# Altium schematic sheet Connector-Sheet.SchDoc
size 420 x 297 mm; SheetNumber: 7; SheetTotal: 7
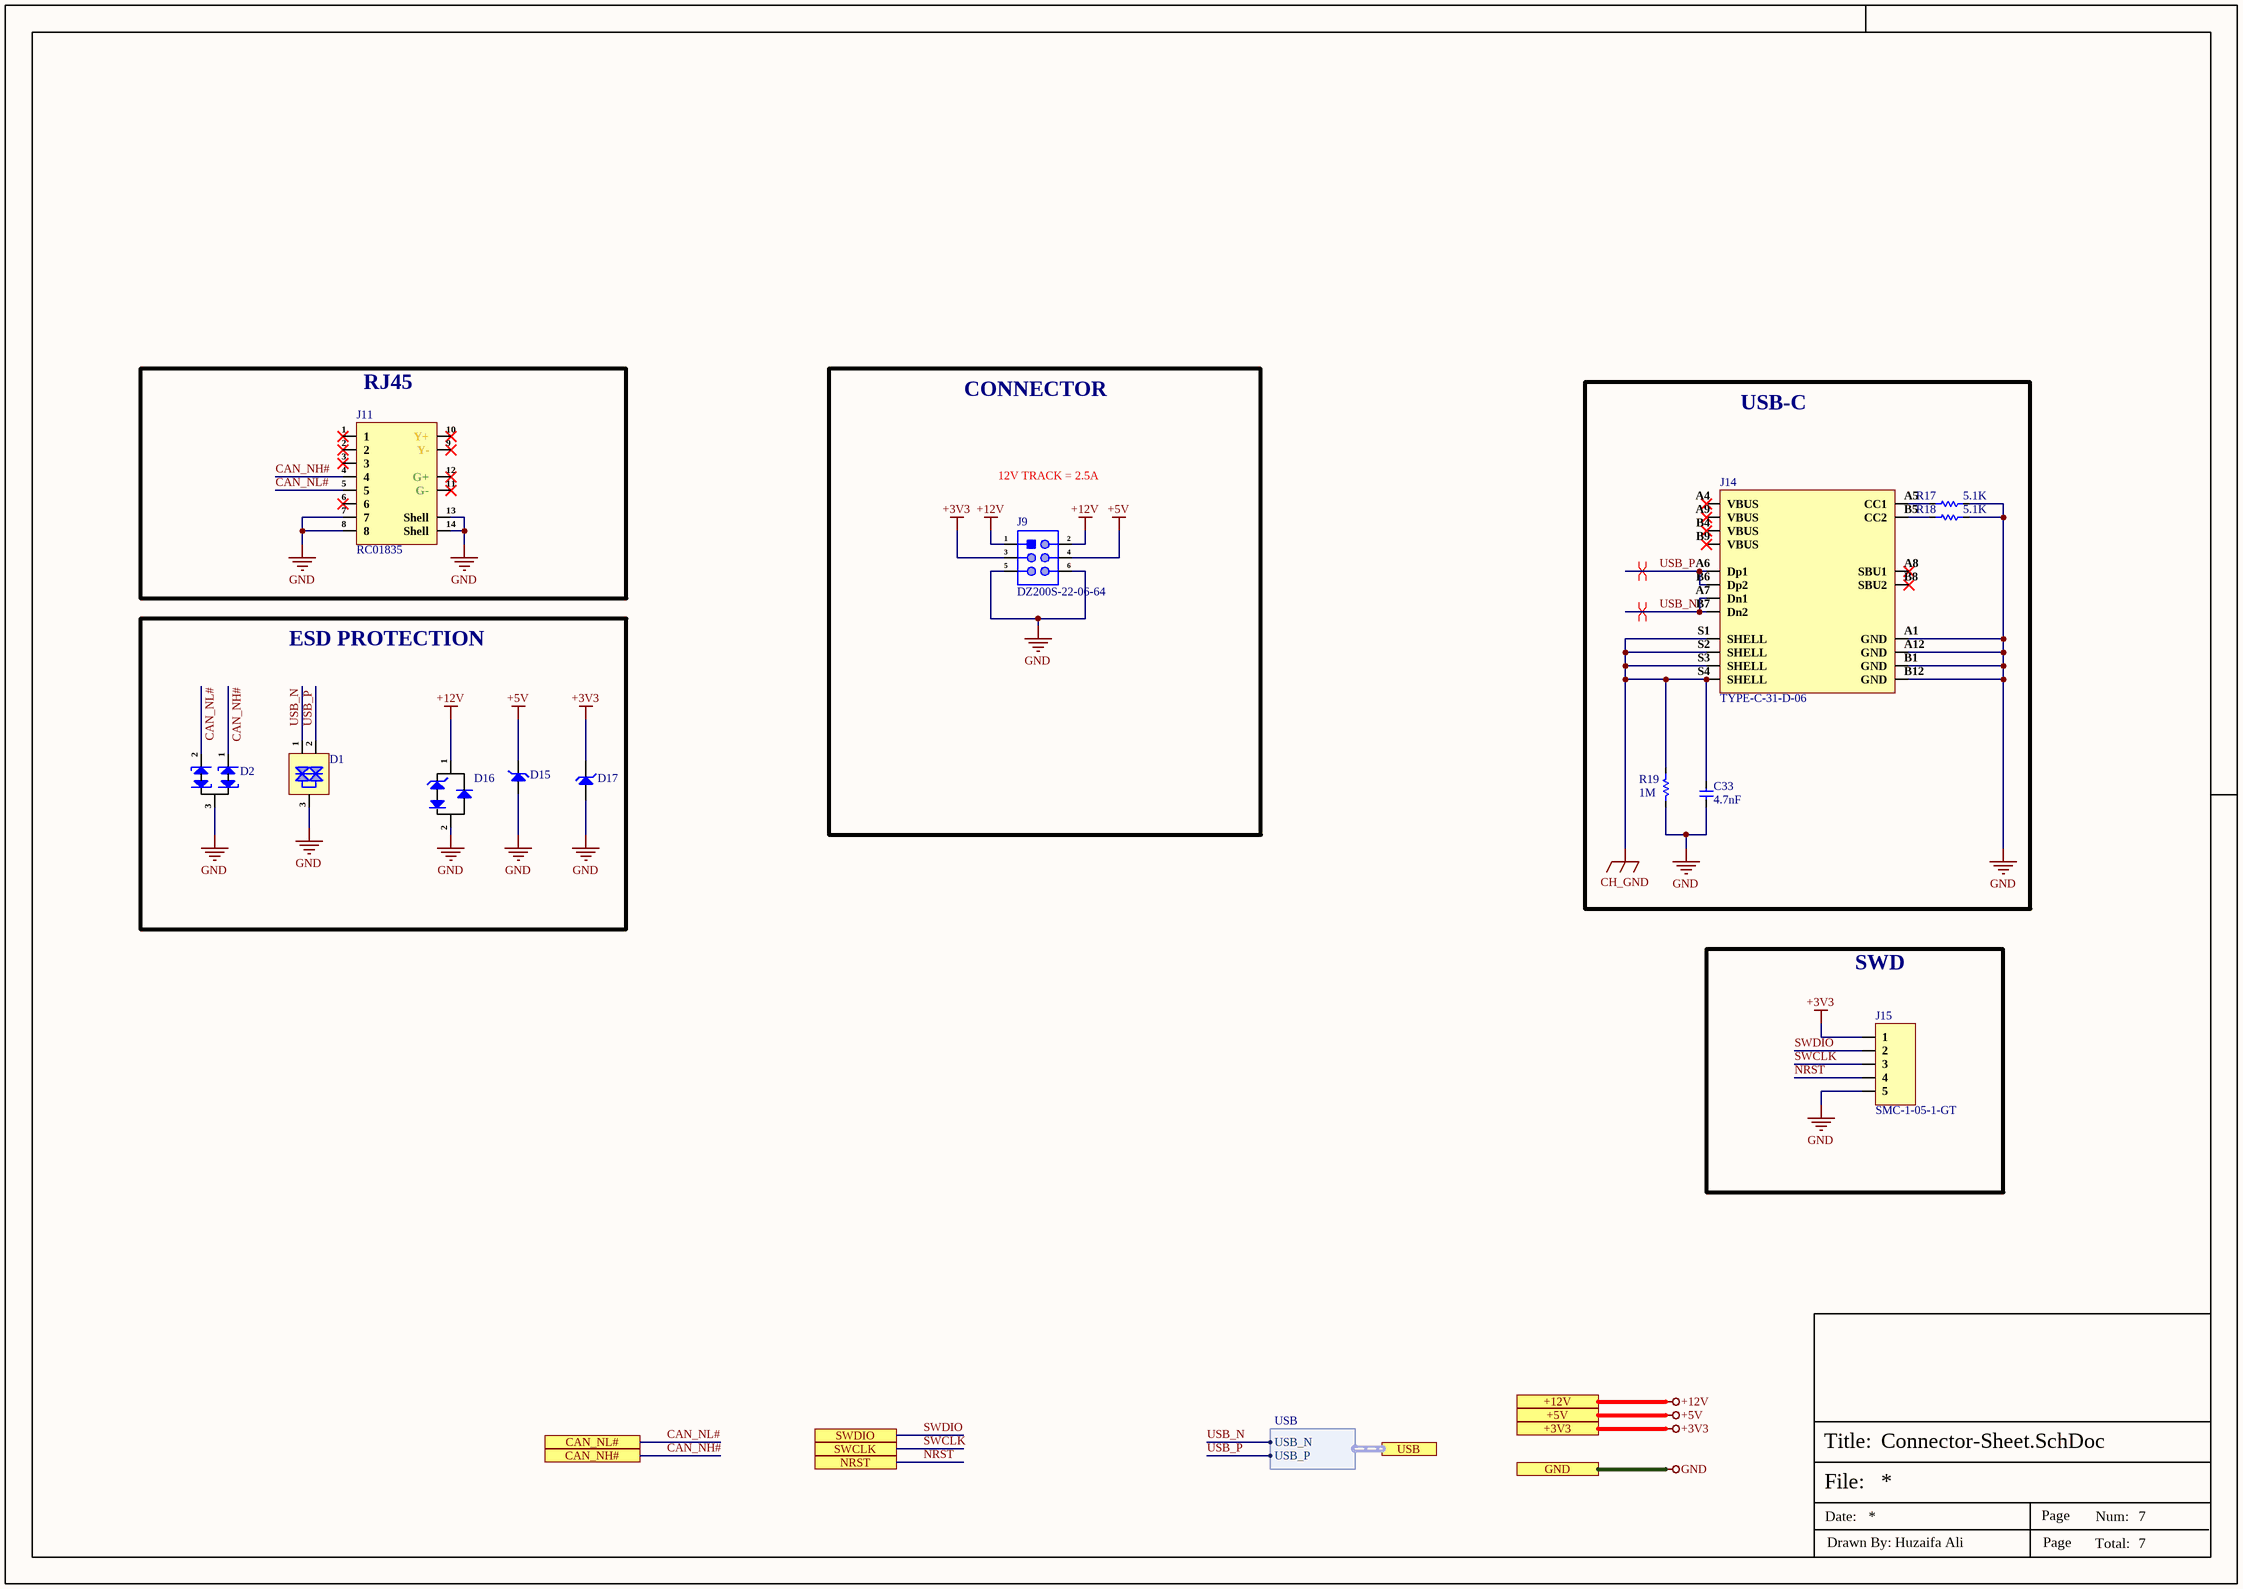
[diagram p0: Connector-Sheet.SchDoc]

## Parts
C33  4.7nF  [Cap-1206]
D1  ESD5302F-3/TR  [Sot-23]  (value not drawn)
D2  PESD2CAN,215  [SOT-23]  (value not drawn)
D15  P6SMB6.8A  [SMB_]  (value not drawn)
D16  SD12LC  [SOD-323]  (value not drawn)
D17  AZ3003-01G  [SOD-123]  (value not drawn)
J9  DZ200S-22-06-64  [HDR 2x3 Male SMD(2mm Pitch)]
J11  RC01835  [RC01835]
J14  TYPE-C-31-D-06  [TYPE-C-31-D-06]
J15  SMC-1-05-1-GT  [SMC-1-05-1-GT]
R17  5.1K  [Res-0402]
R18  5.1K  [Res-0402]
R19  1M  [Res-0603]

## Blocks framed on the sheet
RJ45: J11
CONNECTOR: J9
USB-C: C33 J14 R17-R19
ESD PROTECTION: D1 D2 D15-D17
SWD: J15

## Ports
+3V3 (see Top-Sheet[2B], CAN-Sheet[5D], Controller-Sheet[5D], Current-Sense-Sheet[5D], Motor-Driver-Sheet[5D]), +5V (see Top-Sheet[2A], CAN-Sheet[5D], Motor-Connector[5D]), +12V (see Top-Sheet[2A], Motor-Driver-Sheet[5D]), CAN_NH# (see Top-Sheet[2B], CAN-Sheet[2D]), CAN_NL# (see Top-Sheet[2B], CAN-Sheet[2D]), GND (see Top-Sheet[2B], CAN-Sheet[5D], Controller-Sheet[5D], Current-Sense-Sheet[5D], Motor-Connector[5D], Motor-Driver-Sheet[5D]), NRST (see Top-Sheet[2A], Controller-Sheet[5D]), SWCLK (see Top-Sheet[2B], Controller-Sheet[5D]), SWDIO (see Top-Sheet[2A], Controller-Sheet[5D]), USB (harness USB, see Top-Sheet[2B], Controller-Sheet[4D])

## Harnesses
USB: USB_N, USB_P

## Nets
+3V3: D17.2(K) J9.3 J15.1 ; port +3V3
+5V: D15.2(C) J9.4 ; port +5V
+12V: D16.1(K) J9.1 J9.2 ; port +12V
CH_GND: C33.1 J14.S1(SHELL) J14.S2(SHELL) J14.S3(SHELL) J14.S4(SHELL) R19.1
GND: C33.2 D1.3(GND) D2.3(C_K) D15.1(A) D16.2(A/K) D17.1(A) J9.5 J9.6 J11.7 J11.8 J11.13(Shell) J11.14(Shell) J14.A1(GND) J14.A12(GND) J14.B1(GND) J14.B12(GND) J15.5 R17.2 R18.2 R19.2 ; port GND
CAN_NH#: D2.1(K1) J11.4 ; port CAN_NH#
CAN_NL#: D2.2(K2) J11.5 ; port CAN_NL#
NRST: J15.4 ; port NRST
SWCLK: J15.3 ; port SWCLK
SWDIO: J15.2 ; port SWDIO
USB_N: D1.1(I/O1) J14.A7(Dn1) J14.B7(Dn2) ; port USB.USB_N
USB_P: D1.2(I/O2) J14.A6(Dp1) J14.B6(Dp2) ; port USB.USB_P
NetJ14_A5: J14.A5(CC1) R17.1
NetJ14_B5: J14.B5(CC2) R18.1

Not connected (* = marked no-connect by the designer): J11 1* 2* 3* 6* 9(Y-)* 10(Y+)* 11(G-)* 12(G+)*; J14 A4(VBUS)* A8(SBU1)* A9(VBUS)* B4(VBUS)* B8(SBU2)* B9(VBUS)*

## Layout directives
differential pair; net class USB; differential pair class USB_Lines; rule Impedance Constraint [Min = 88.00    Max = 90.00    ]; rule Matched Net Lengths [Tolerance = 20mil]: USB_N, USB_P

## Notes on the sheet
- 12V TRACK = 2.5A
- File:
- Title:
- Date:
- Page
- Num:
- Total:
- Drawn By: Huzaifa Ali

## Library data of the parts
C33 = CC1206KKX7RCBB472: CAP CER 4700PF 1KV X7R 1206; Manufacturer: Yageo; Dielectric Material: Ceramic; Tolerance: 10%; Item Type: Capacitor; Supplier 1: Future Electronics; Manufacturer Part Number: CC1206KKX7RCBB472; RoHS: Yes; Category: Ceramic Capacitors; Stock 1: 180000; Pricing 1: 3000=0.02860, 9000=0.02750, 15000=0.02700, 45000=0.02600, 75000=0.02510 (USD); Mount: Surface Mount; Case/Package: 1206; Number of Pins: 2; Case Code (Imperial): 1206; Case Code (Metric): 3216; Weight: 0.000571oz; Min Operating Temperature: -55°C; Max Operating Temperature: 125°C; Voltage Rating: 1kV; Capacitance: 4.7nF; Packaging: Tape and Reel; Voltage Rating (DC): 1kV; Dielectric: X7R; Termination: SMD/SMT; Resistor Type: Ceramic; Series: CC; Length: 3.2mm; Width: 0.063inch; Thickness: 0.057inch; Depth: 1.6mm; Radiation Hardening: No; Lead Free: Lead Free; RoHS Compliant: Yes; ComponentLink1URL: https://datasheet.ciiva.com/13208/upy-gp-np0-16v-to-50v-8-13208693.pdf?src-supplier=Mouser; ComponentLink1Description: https://datasheet.ciiva.com/13208/upy-gp-np0-16v-to-50v-8-13208693.pdf?src-supplier=Mouser; ComponentLink2URL: https://datasheet.ciiva.com/11466/hv-11466701.pdf?src-supplier=Avnet; ComponentLink2Description: https://datasheet.ciiva.com/11466/hv-11466701.pdf?src-supplier=Avnet; Supplier Part Number 1: 7130131; LCSC Part Number: C107198
D1 = ESD5302F-3/TR: 16A 20V 7V 5V@Max Unidirectional SOT-23 TVS ROHS; Manufacturer: WILLSEMI; Item Type: Diode; Manufacturer Part Number: ESD5302F-3/TR; Package: SOT-23; LCSC Part Number: C239643; ComponentLink1Description: LCSC; ComponentLink1URL: https://www.lcsc.com/product-detail/TVS_WILLSEMI-Will-Semicon-ESD5302F-3-TR_C239643.html
D2 = PESD2CAN,215: TVS DIODE 24VWM 41VC TO236AB; Manufacturer: Nexperia; Supplier 1: Arrow Electronics; Manufacturer Part Number: PESD2CAN,215; RoHS: No; Category: ESD and Circuit Protection ICs; Stock 1: 775; Pricing 1: 1=0.48690, 10=0.40120, 25=0.38650, 50=0.33780, 100=0.25440, 250=0.25380, 500=0.25120 (USD); ComponentLink1URL: http://www.farnell.com/datasheets/1750978.pdf?src-supplier=Farnell; ComponentLink1Description: http://www.farnell.com/datasheets/1750978.pdf?src-supplier=Farnell; ComponentLink2URL: https://assets.nexperia.com/documents/data-sheet/PESD2CAN.pdf?src-supplier=Digi-Key; ComponentLink2Description: https://assets.nexperia.com/documents/data-sheet/PESD2CAN.pdf?src-supplier=Digi-Key; ComponentLink3URL: http://www.farnell.com/datasheets/1750978.pdf?src-supplier=Newark; ComponentLink3Description: http://www.farnell.com/datasheets/1750978.pdf?src-supplier=Newark; Supplier Part Number 1: PESD2CAN,215; LCSC Part Number: C75176
D15 = P6SMB6.8A: 58.1A 600W 10.5V@58.1A 6.45V Unidirectional 5.8V SMB Electrostatic and Surge Protection (TVS/ESD) ROHS; Manufacturer: BORN; Manufacturer Part Number: P6SMB6.8A; Package: SMB; LCSC Part Number: C5439947; Item Type: TVS/ESD; ComponentLink1Description: LCSC; ComponentLink1URL: https://www.lcsc.com/product-detail/Electrostatic-and-Surge-Protection-TVS-ESD_BORN-P6SMB6-8A_C5439947.html
D16 = SD12LC: TVS DIODE 12VWM 28.6VC SOD323; Manufacturer: Sangdest Microelectronics; Supplier: DigiKey; Supplier Part Number: 1655-SD12LCCT-ND; Manufacturer Part Number: SD12LC; Stock: 575; Pricing: 1=0.43, 10=0.305, 100=0.1541, 500=0.13654, 1000=0.10625 (USD); Item Type: Diode
D17 = AZ3003-01G: TVS SURGE PROTECTOR 1-CH 3.3V; Manufacturer: Amazing; Item Type: Diode; Manufacturer Part Number: AZ3003-01G; Package: SOD-123; LCSC Part Number: -; ComponentLink1Description: Digikey; ComponentLink1URL: https://www.digikey.com/en/products/detail/amazing/AZ3003-01G/16615352?s=N4IgTCBcDaIIIC0DMAGFSC0KCMBxEAugL5A
J9 = DZ200S-22-06-64: Brick nogging Square Pins 6P 2mm 双排 2x3P SMD,P=2mm Pin Headers ROHS; Manufacturer: DEALON; Item Type: Connector; Manufacturer Part Number: DZ200S-22-06-64; LCSC Part Number: C5160768; Package: SMD,P=2mm; ComponentLink1Description: LCSC Link; ComponentLink1URL: https://www.lcsc.com/product-detail/Pin-Headers_DEALON-DZ200S-22-06-64_C5160768.html
J11 = RC01835: RJ45 RJReceptacle 1 有屏蔽 Sink board WithLED -40℃~+70℃ Plugin Ethernet Connectors/Modular Connectors (RJ45 RJ11) ROHS; Manufacturer: RCH; Manufacturer Part Number: RC01835; Package: Plugin; LCSC Part Number: C708648; Item Type: Ethernet; ComponentLink1Description: LCSC; ComponentLink1URL: https://www.lcsc.com/product-detail/Ethernet-Connectors-Modular-Connectors-RJ45-RJ11_RCH-RC01835_C708648.html
J14 = TYPE-C-31-D-06: 1 Brick nogging 16 Female -25℃~+85℃ Type-C SMD USB Connectors ROHS; Manufacturer: Korean Hroparts Elec; Manufacturer Part Number: TYPE-C-31-D-06; Package: Custom; LCSC Part Number: C2689964; Item Type: USB Connector; ComponentLink1Description: LCSC; ComponentLink1URL: https://www.lcsc.com/product-detail/USB-Connectors_Korean-Hroparts-Elec-TYPE-C-31-D-06_C2689964.html
J15 = SMC-1-05-1-GT: MACHINE PIN SOCKET 5P 2.54MM PIT; Manufacturer: Adam Equipment; Item Type: Pin Header; Supplier 1: Digi-Key; Manufacturer Part Number: SMC-1-05-1-GT; RoHS: No; Stock 1: 1697; Pricing 1: 1=0.41000, 10=0.38500, 25=0.33040, 50=0.28080, 100=0.26970, 250=0.24224, 500=0.23120, 1000=0.19268, 2500=0.17616 (USD); Supplier Part Number 1: 2057-SMC-1-05-1-GT-ND; LCSC Part Number: C3320109
R17 R18 = RC0402FR-075K1L: RES 5.1K OHM 1% 1/16W 0402; Manufacturer: Yageo; Power Rating: 63mW; Resistance: 5.1kR; Temperature Coefficient: 100ppm/°C; Voltage Rating: 50V; Item Type: Resistor; Supplier 1: Avnet; Manufacturer Part Number: RC0402FR-075K1L; RoHS: Yes; Category: Chip SMD Resistors; Stock 1: 65000; Pricing 1: 10000=0.00085 (USD); Case/Package: 0402; Case Code (Metric): 1005; Case Code (Imperial): 0402; Min Operating Temperature: -55°C; Max Operating Temperature: 155°C; Tolerance: 1%; Technology: THICK FILM; Packaging: Tape and Reel; Package Quantity: 1; Resistor Type: Thick Film; Number of Terminations: 2; Termination: SMD/SMT; Max Power Dissipation: 63mW; Voltage Rating (DC): 50V; Working Voltage: 50V; Features: Moisture Resistant; Series: RC; Resistance Tolerance: 1%; Construction: Rectangular; Length: 1mm; Width: 0.02inch; Height: 0.016inch; Depth: 0.5mm; RoHS Compliant: Yes; Military Standard: Not; Lead Free: Lead Free; ComponentLink1URL: https://datasheet.ciiva.com/7983/1018594-7983519.pdf?src-supplier=Element14; ComponentLink1Description: https://datasheet.ciiva.com/7983/1018594-7983519.pdf?src-supplier=Element14; ComponentLink2URL: https://datasheet.ciiva.com/46394/1018594-46394936.pdf?src-supplier=Element14; ComponentLink2Description: https://datasheet.ciiva.com/46394/1018594-46394936.pdf?src-supplier=Element14; ComponentLink3URL: https://datasheet.ciiva.com/2453/pyu-r-int-thick-7-2453401.pdf?src-supplier=Digi-Key; ComponentLink3Description: https://datasheet.ciiva.com/2453/pyu-r-int-thick-7-2453401.pdf?src-supplier=Digi-Key; ComponentLink4URL: https://datasheet.ciiva.com/2453/pyu-r-int-thick-7-2453402.pdf?src-supplier=Digi-Key; ComponentLink4Description: https://datasheet.ciiva.com/2453/pyu-r-int-thick-7-2453402.pdf?src-supplier=Digi-Key; ComponentLink5URL: https://datasheet.ciiva.com/2453/pyu-r-int-thick-7-2453400.pdf?src-supplier=Digi-Key; ComponentLink5Description: https://datasheet.ciiva.com/2453/pyu-r-int-thick-7-2453400.pdf?src-supplier=Digi-Key; ComponentLink6URL: https://datasheet.ciiva.com/12558/pyu-rc0402-51-rohs-l-6-r-8721-12558460.pdf?src-supplier=Mouser; ComponentLink6Description: https://datasheet.ciiva.com/12558/pyu-rc0402-51-rohs-l-6-r-8721-12558460.pdf?src-supplier=Mouser; ComponentLink7URL: https://datasheet.ciiva.com/16744/pyu-rc0402-51-rohs-l-6-r-16744283.pdf?src-supplier=Future+Electronics; ComponentLink7Description: https://datasheet.ciiva.com/16744/pyu-rc0402-51-rohs-l-6-r-16744283.pdf?src-supplier=Future+Electronics; ComponentLink8URL: https://datasheet.ciiva.com/15189/getdatasheetpartid-323636-15189493.pdf?src-supplier=Verical; ComponentLink8Description: https://datasheet.ciiva.com/15189/getdatasheetpartid-323636-15189493.pdf?src-supplier=Verical; Supplier Part Number 1: RC0402FR-075K1L; LCSC Part Number: C105872
R19 = RC0603FR-071ML: RES SMD 1M OHM 1% 1/10W 0603; Manufacturer: Yageo; Voltage Rating: 50V; Resistance: 1MR; Power Rating: 100mW; Temperature Coefficient: 100ppm/°C; Item Type: Resistor; Supplier 1: Digi-Key; Manufacturer Part Number: RC0603FR-071ML; Stock 1: 3824601; Pricing 1: 1=0.1, 10=0.023, 100=0.0094, 1000=0.00421, 2500=0.00366 (USD); Case/Package: 0603; Number of Pins: 2; Case Code (Imperial): 0603; Case Code (Metric): 1608; Min Operating Temperature: -55°C; Max Operating Temperature: 155°C; Voltage Rating (DC): 50V; Tolerance: 1%; Packaging: Tape and Reel; Package Quantity: 5000; Termination: SMD/SMT; Composition: Thick Film; Military Standard: Not; Length: 1.6mm; Height: 0.45mm; Width: 0.8mm; Depth: 0.8mm; REACH SVHC: No SVHC; Lead Free: Lead Free; ComponentLink1URL: http://www.farnell.com/datasheets/2167052.pdf?src-supplier=Mouser; ComponentLink1Description: http://www.farnell.com/datasheets/2167052.pdf?src-supplier=Mouser; ComponentLink2URL: http://www.farnell.com/datasheets/2167052.pdf?src-supplier=Element14; ComponentLink2Description: http://www.farnell.com/datasheets/2167052.pdf?src-supplier=Element14; ComponentLink3URL: http://documents.rs-components.com/techlib://itc_doclist_GB.htm?stockno=5048956&src-supplier=RSComponents; ComponentLink3Description: http://documents.rs-components.com/techlib://itc_doclist_GB.htm?stockno=5048956&src-supplier=RSComponents; Supplier Part Number 1: 311-1.00MHRDKR-ND; LCSC Part Number: C105578